# Altium schematic sheet Edge_Card_Ucc28951.SchDoc
size A4
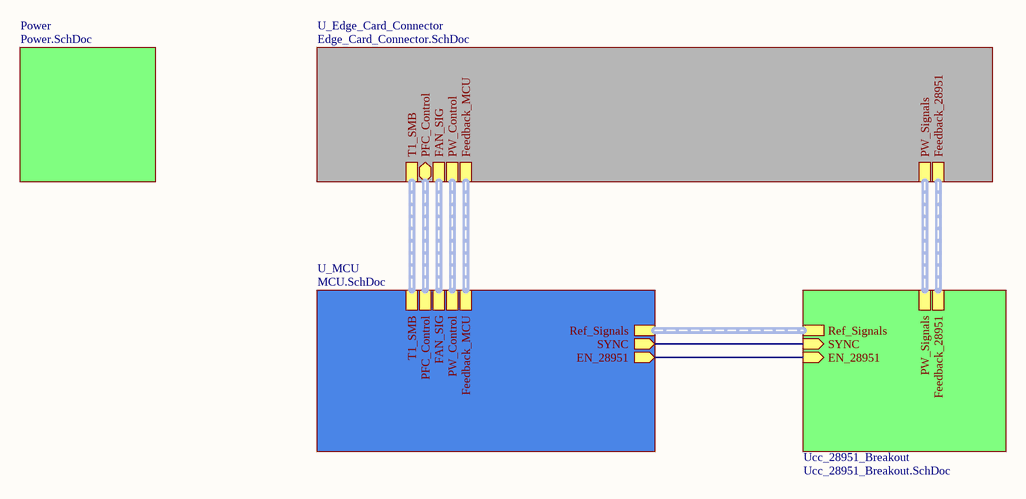
[diagram p0: Edge_Card_Ucc28951.SchDoc]

## Sub-sheets
Power = Power.SchDoc: no entries
U_Edge_Card_Connector = Edge_Card_Connector.SchDoc: Feedback_28951 (harness Feedback_28951), Feedback_MCU (harness Feedback_MCU), FAN_SIG (harness FAN_SIG), PFC_Control (bidir, harness PFC_Control), T1_SMB (harness T1_SMB), PW_Signals (harness PW_Signals), PW_Control (harness PW_Control)
U_MCU = MCU.SchDoc: T1_SMB (harness T1_SMB), PFC_Control (harness PFC_Control), FAN_SIG (harness FAN_SIG), PW_Control (harness PW_Control), Feedback_MCU (harness Feedback_MCU), SYNC (out), EN_28951 (out), Ref_Signals (harness Ref_Signals)
Ucc_28951_Breakout = Ucc_28951_Breakout.SchDoc: PW_Signals (harness PW_Signals), Feedback_28951 (harness Feedback_28951), EN_28951 (in), SYNC (in), Ref_Signals (harness Ref_Signals)

## Nets
(unnamed): sheet U_MCU/SYNC, sheet Ucc_28951_Breakout/SYNC
(unnamed): sheet U_MCU/EN_28951, sheet Ucc_28951_Breakout/EN_28951

## Buses and harness runs
harness sheet U_Edge_Card_Connector/FAN_SIG = sheet U_MCU/FAN_SIG
harness sheet U_Edge_Card_Connector/Feedback_28951 = sheet Ucc_28951_Breakout/Feedback_28951
harness sheet U_Edge_Card_Connector/Feedback_MCU = sheet U_MCU/Feedback_MCU
harness sheet U_Edge_Card_Connector/PFC_Control = sheet U_MCU/PFC_Control
harness sheet U_Edge_Card_Connector/PW_Control = sheet U_MCU/PW_Control
harness sheet U_Edge_Card_Connector/PW_Signals = sheet Ucc_28951_Breakout/PW_Signals
harness sheet U_Edge_Card_Connector/T1_SMB = sheet U_MCU/T1_SMB
harness sheet U_MCU/Ref_Signals = sheet Ucc_28951_Breakout/Ref_Signals